# EAGLE design irams2 (EAGLE 5.11)
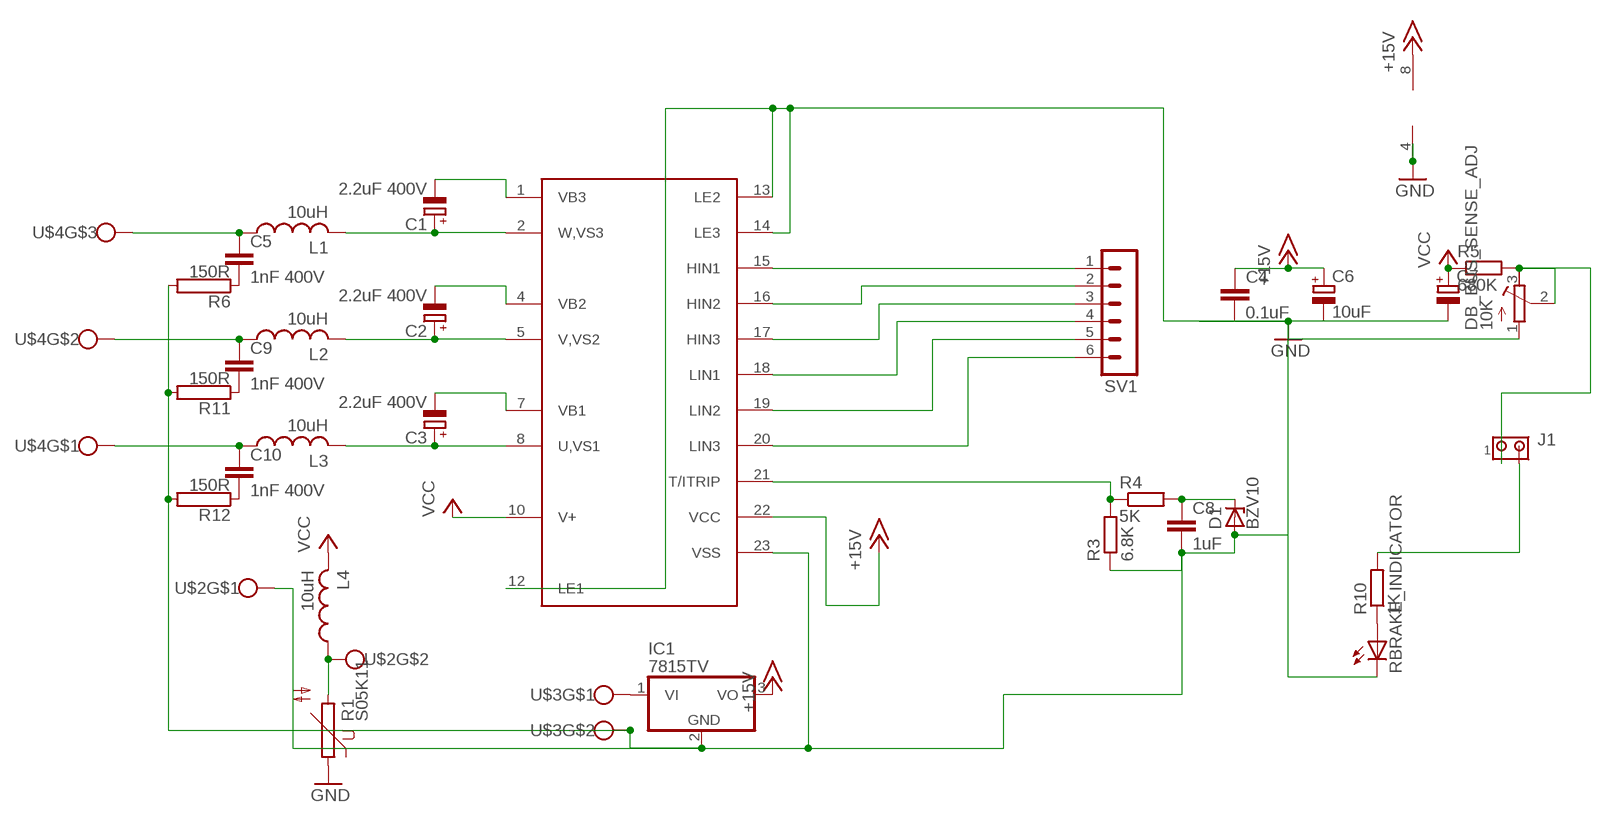
[diagram p0: schematic, sheet 1]

## Parts
C1  2.2uF 400V  CPOL-EUE5-10.5  [E5-10,5]
C2  2.2uF 400V  CPOL-EUE5-10.5  [E5-10,5]
C3  2.2uF 400V  CPOL-EUE5-10.5  [E5-10,5]
C4  0.1uF  C-EUC0805K  [C0805K]
C5  1nF 400V  C-EU075-063X106  [C075-063X106]
C6  10uF  CPOL-EUE2.5-5  [E2,5-5]
C7  CPOL-EUE10-30  [EB30D]
C8  1uF  C-EUC0805K  [C0805K]
C9  1nF 400V  C-EU075-063X106  [C075-063X106]
C10  1nF 400V  C-EU075-063X106  [C075-063X106]
D1  BZV10  ZENER-DIODESOD80C  [SOD80C]
DB_BUS_SENSE_ADJ  10K  R-TRIMM3339P  [RTRIM3339P]
IC1  7815TV  [TO220V]
IC2  LM358D  [SO08]
J1  MTA02-100  [10X02MTA]
L1  10uH  L-USTJ3-U1  [TJ3-U1]
L2  10uH  L-USTJ3-U1  [TJ3-U1]
L3  10uH  L-USTJ3-U1  [TJ3-U1]
L4  10uH  L-USTJ3-U1  [TJ3-U1]
R1  S05K11  [S05K11]
R3  6.8K  R-EU_M0805  [M0805]
R4  5K  R-EU_M0805  [M0805]
R5  680K  R-EU_0204/7  [0204/7]
R6  150R  RKH216-8  [KH216-8]
R10  1K  R-EU_M0805  [M0805]
R11  150R  RKH216-8  [KH216-8]
R12  150R  RKH216-8  [KH216-8]
RBRAKE_INDICATOR  LED5MM  [LED5MM]
SV1  MA06-1  [MA06-1]
U$1  IRAMS06UP60A  IRAMS06UP60ASIP-1  [SIP-1]
U$2  110/2  [110/2]
U$3  110/2  [110/2]
U$4  110/3  [110/3]

## Nets
+15V: C4.1 C6.+ IC1.3(VO) IC2.8(P:V+) U$1.22(VCC)
GND: C4.2 C6.- C7.- C8.2 D1.A DB_BUS_SENSE_ADJ.1(E) IC1.2(GND) IC2.4(P:V-) R1.1 R3.1 R6.2 R11.2 R12.2 RBRAKE_INDICATOR.K(C) U$1.12(LE1) U$1.13(LE2) U$1.14(LE3) U$1.23(VSS) U$2.P$1 U$3.P$2
N$1: SV1.1 U$1.15(HIN1)
N$2: SV1.2 U$1.16(HIN2)
N$3: SV1.3 U$1.17(HIN3)
N$4: SV1.4 U$1.18(LIN1)
N$5: SV1.5 U$1.19(LIN2)
N$6: SV1.6 U$1.20(LIN3)
N$7: C3.+ L3.2 U$1.8(U,VS1)
N$8: C3.- U$1.7(VB1)
N$9: C2.+ L2.2 U$1.5(V,VS2)
N$10: C2.- U$1.4(VB2)
N$11: C1.+ L1.2 U$1.2(W,VS3)
N$12: C1.- U$1.1(VB3)
N$13: L4.1 R1.2 U$2.P$2
N$15: DB_BUS_SENSE_ADJ.2(S) DB_BUS_SENSE_ADJ.3(A) J1.1 R5.2
N$16: R10.1 RBRAKE_INDICATOR.A
N$18: IC1.1(VI) U$3.P$1
N$19: R3.2 R4.1 U$1.21(T/ITRIP)
N$20: C8.1 D1.C R4.2
N$24: J1.2 R10.2
N$26: C5.1 L1.1 U$4.P$3
N$27: C9.1 L2.1 U$4.P$2
N$28: C10.1 L3.1 U$4.P$1
N$29: C9.2 R11.1
N$30: C10.2 R12.1
N$31: C5.2 R6.1
VCC: C7.+ L4.2 R5.1 U$1.10(V+)
Unconnected: IC2.1(A:OUT) IC2.2(A:-IN) IC2.3(A:+IN) IC2.5(B:+IN) IC2.6(B:-IN) IC2.7(B:OUT)

## Library data of the parts
C1-C3 C6 C7 = resistor:CPOL-EU: POLARIZED CAPACITOR, European symbol
C4 C5 C8-C10 = resistor:C-EU: CAPACITOR, European symbol
D1 = diode:ZENER-DIODE: Z-Diode
DB_BUS_SENSE_ADJ = resistor:R-TRIMM: Trimm resistor
IC1 = linear:78*: Positive VOLTAGE REGULATOR Source: http://cache.national.com/ds/LM/LM78L05.pdf http://www.fairchildsemi.com/ds/LM/LM7805.pdf
IC2 = linear:LM358: OP AMP also LM158; LM258; LM2904 Source: http://cache.national.com/ds/LM/LM158.pdf
J1 = con-amp:MTA02-100: AMP connector; OC_FARNELL: unknown; OC_NEWARK: unknown
L1-L4 = resistor:L-US: INDUCTOR, American symbol
R1 = varistor:S05K11: VARISTOR
R3 R4 R10 = resistor:R-EU_: RESISTOR, European symbol
R5 = rcl:R-EU_: RESISTOR, European symbol
R6 R11 R12 = resistor-power:R: Power Resitor; OC_FARNELL: unknown; OC_NEWARK: unknown
RBRAKE_INDICATOR = led:LED: LED OSRAM: - CHIPLED LG R971, LG N971, LY N971, LG Q971, LY Q971, LO R971, LY R971 LH N974, LH R974 LS Q976, LO Q976, LY Q976 LO Q996 - Hyper CHIPLED LW Q18S LB Q993, LB Q99A, LB R99A - SideLED LS A670, LO A670, LY A670, LG A670, LP A670 LB A673, LV A673, LT A673, LW A673 LH A674 LY A675 LS A676, LA A676, LO A676, LY A676, LW A676 LS A679, LY A679, LG A679 - Hyper Micro SIDELED® LS Y876, LA Y876, LO Y876, LY Y876 LT Y87S - SmartLED LW L88C, LW L88S LB L89C, LB L89S, LG L890 LS L89K, LO L89K, LY L89K LS L896, LA L896, LO L896, LY L896 - TOPLED LS T670, LO T670, LY T670, LG T670, LP T670 LSG T670, LSP T670, LSY T670, LOP T670, LYG T670 LG T671, LOG T671, LSG T671 LB T673, LV T673, LT T673, LW T673 LH T674 LS T676, LA T676, LO T676, LY T676, LB T676, LH T676, LSB T676, LW T676 LB T67C, LV T67C, LT T67C, LS T67K, LO T67K, LY T67K, LW E67C LS E67B, LA E67B, LO E67B, LY E67B, LB E67C, LV E67C, LT E67C LW T67C LS T679, LY T679, LG T679 LS T770, LO T770, LY T770, LG T770, LP T770 LB T773, LV T773, LT T773, LW T773 LH T774 LS E675, LA E675, LY E675, LS T675 LS T776, LA T776, LO T776, LY T776, LB T776 LHGB T686 LT T68C, LB T68C - Hyper Mini TOPLED® LB M676 - Mini TOPLED Santana® LG M470 LS M47K, LO M47K, LY M47K Source: http://www.osram.convergy.de LUXEON: - LUMILED® LXK2-PW12-R00, LXK2-PW12-S00, LXK2-PW14-U00, LXK2-PW14-V00 LXK2-PM12-R00, LXK2-PM12-S00, LXK2-PM14-U00 LXK2-PE12-Q00, LXK2-PE12-R00, LXK2-PE12-S00, LXK2-PE14-T00, LXK2-PE14-U00 LXK2-PB12-K00, LXK2-PB12-L00, LXK2-PB12-M00, LXK2-PB14-N00, LXK2-PB14-P00, LXK2-PB14-Q00 LXK2-PR12-L00, LXK2-PR12-M00, LXK2-PR14-Q00, LXK2-PR14-R00 LXK2-PD12-Q00, LXK2-PD12-R00, LXK2-PD12-S00 LXK2-PH12-R00, LXK2-PH12-S00 LXK2-PL12-P00, LXK2-PL12-Q00, LXK2-PL12-R00 Source: www.luxeon.com KINGBRIGHT: KA-3528ASYC Source: www.kingbright.com
SV1 = con-lstb:MA06-1: PIN HEADER; OC_FARNELL: unknown; OC_NEWARK: unknown
U$1 = motor driver parts:IRAMS06UP60A
U$2 U$3 = con-wago-500:110/2
U$4 = con-wago-500:110/3

## Board
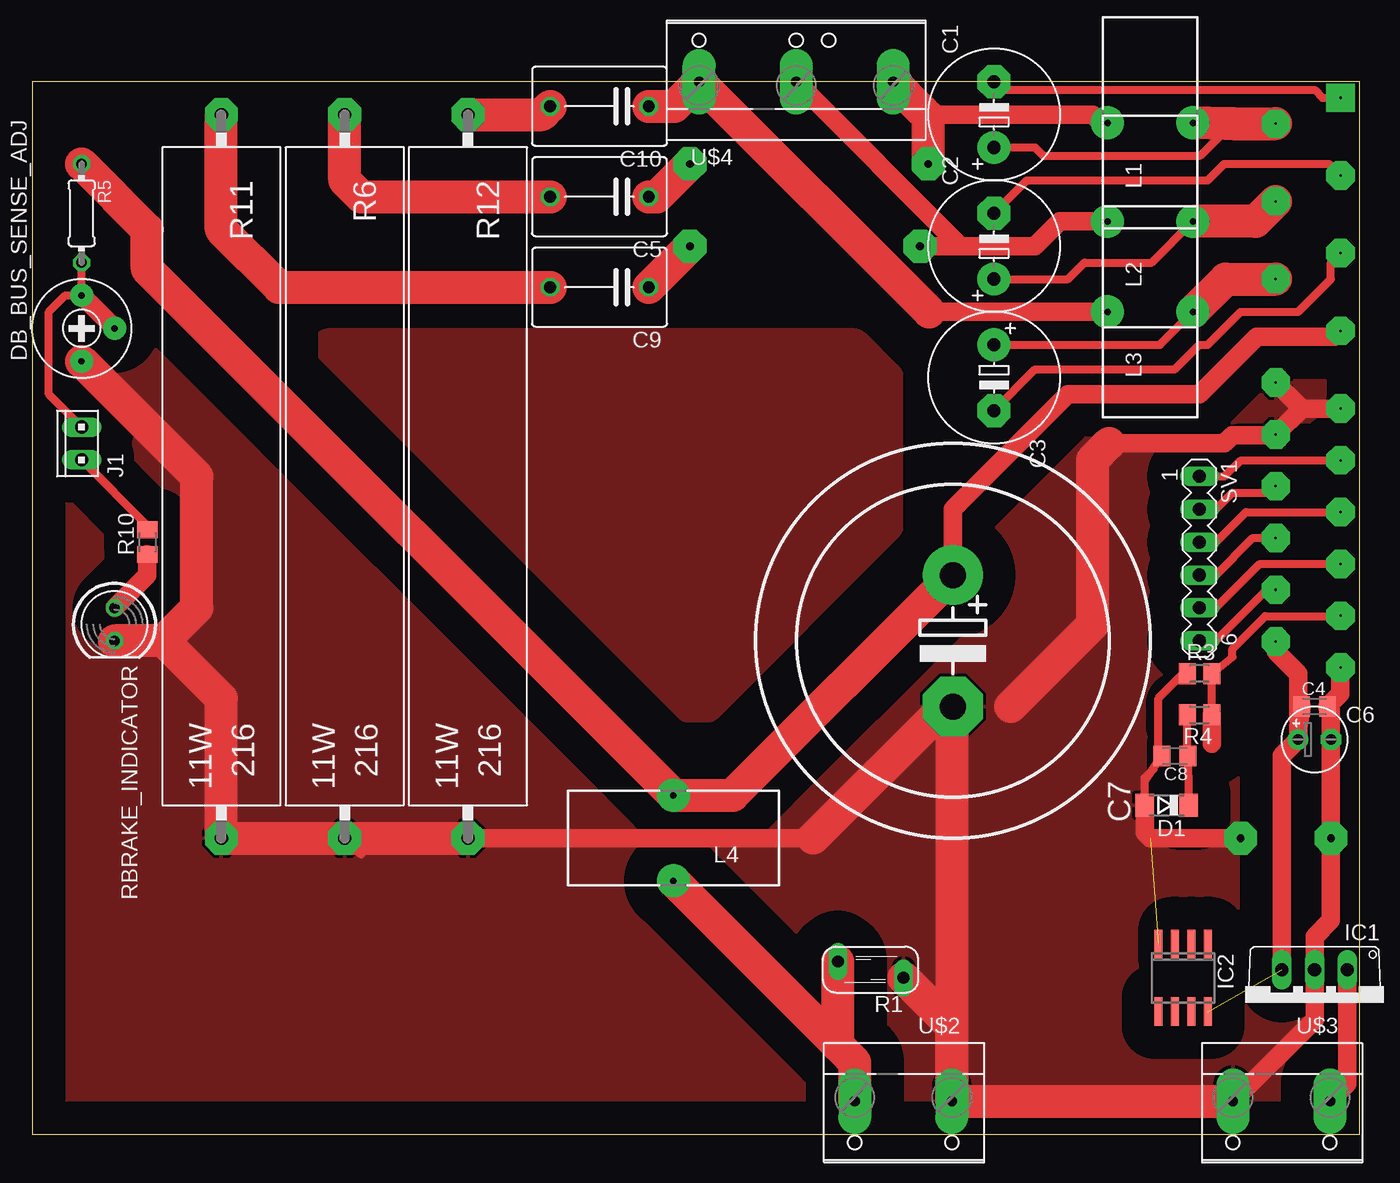
[diagram p1: board, top side]
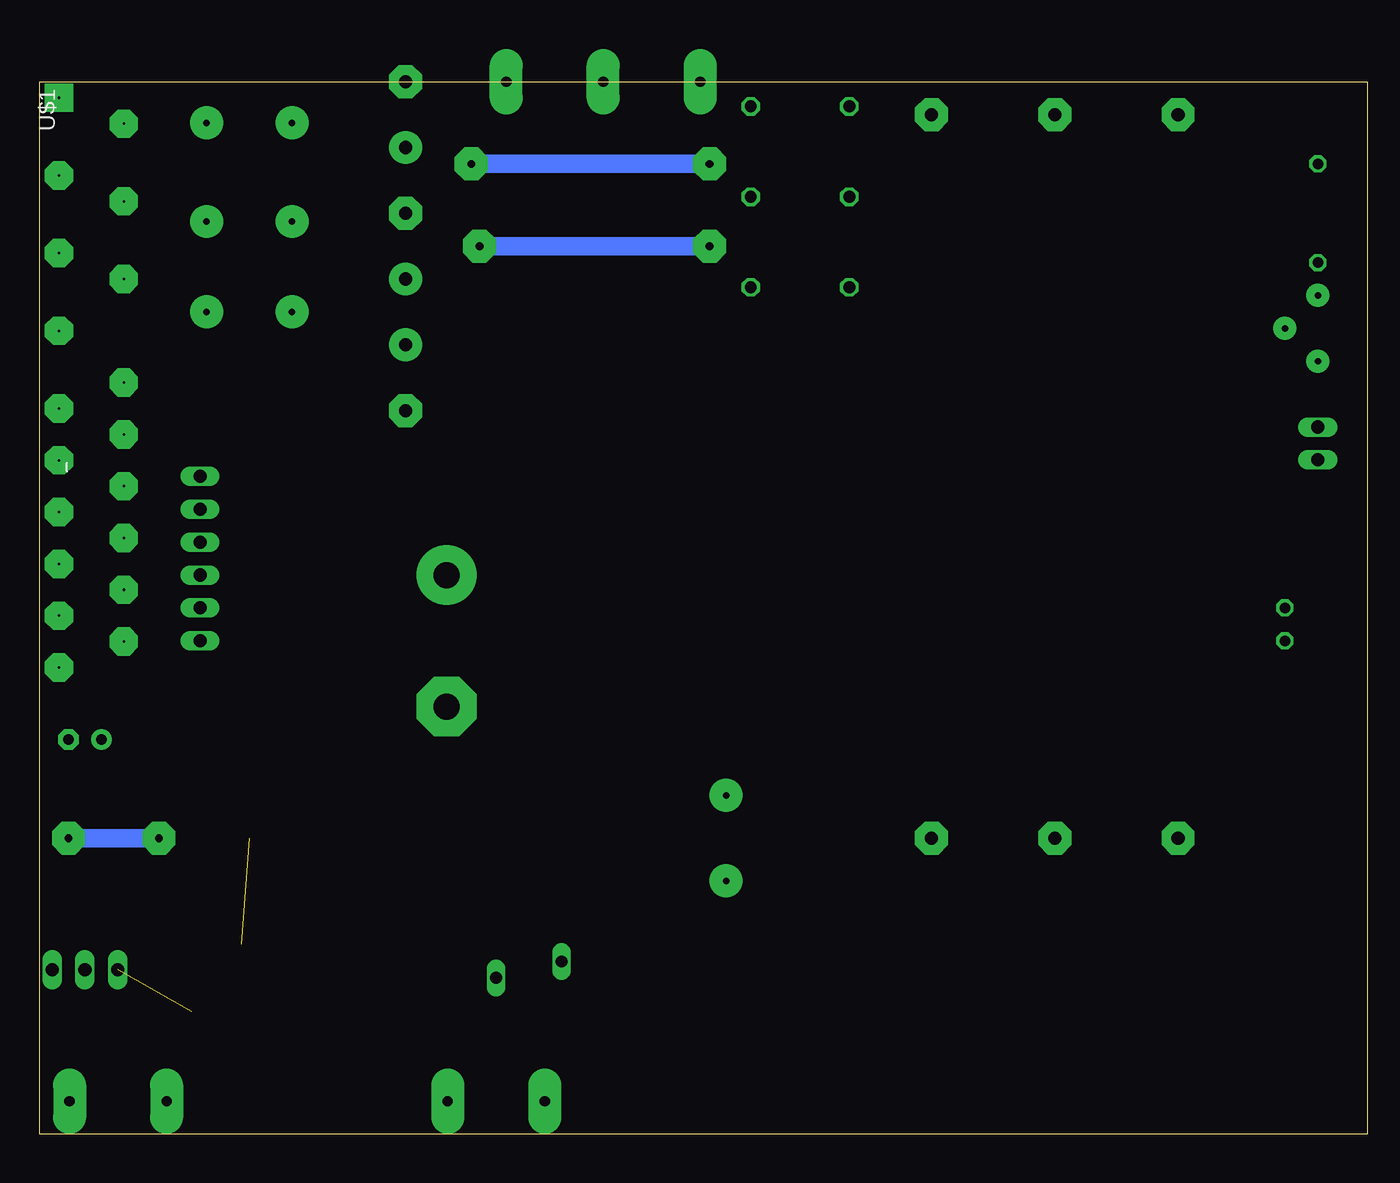
[diagram p2: board, bottom side, seen from below]

Size 102.54 x 81.27 mm. Coordinates in mm from the lower left corner, seen from the top.
Outline: 0,0 102.54,0 102.54,81.27 0,81.27 0,0
Copper layers (1*16): Top 0.035mm / dielectric 1.5mm / Bottom 0.035mm
Design rules "default": minimum track width 10mil, minimum drill 24mil, track to track 8mil, track to pad 8mil, pad to pad 8mil, via to via 8mil, smd to smd 8mil, copper to edge 40mil, drill to drill 8mil, minimum pad ring 10mil, minimum via ring 8mil, stop-mask expansion 4mil, vias tented up to drill 0mil, thermal gap 10mil

### Footprints (pad centres in the part's own frame; a part is rotated, then mirrored left to right if it is on the bottom)
E5-10,5 = drill 1.016 pad 2.54 round: + -2.54,0 | drill 1.016 pad 2.54 octagon: - 2.54,0
C0805K = smd 1.3 x 1.6: 1 -1,0; 2 1,0
C075-063X106 = drill 0.914 octagon: 1 -3.81,0; 2 3.81,0
E2,5-5 = drill 0.813 pad 1.6 round: + -1.27,0 | drill 0.813 pad 1.6 octagon: - 1.27,0
EB30D = drill 2.007 pad 4.597 round: + -5.08,0 | drill 2.007 pad 4.597 octagon: - 5.08,0
SOD80C = smd 1.4 x 1.8: A 1.7,0; C -1.7,0
RTRIM3339P = drill 0.5 pad 1.778 round: 1 -2.54,0; 2 0,-2.54; 3 2.54,0
TO220V = drill 1.016 long: 1 -2.54,-2.54; 2 0,-2.54; 3 2.54,-2.54
SO08 = smd 0.6 x 2.2: 1 -1.905,-2.6; 2 -0.635,-2.6; 3 0.635,-2.6; 4 1.905,-2.6; 5 1.905,2.6; 6 0.635,2.6; 7 -0.635,2.6; 8 -1.905,2.6
10X02MTA = drill 1.016 long: 1 1.27,0; 2 -1.27,0
TJ3-U1 = drill 0.5 pad 2.54 round: 1 -3.3,0; 2 3.3,0
S05K11 = drill 0.914 long: 1 -0.635,-2.54; 2 0.635,2.54
M0805 = smd 1.3 x 1.6: 1 -0.95,0; 2 0.95,0
0204/7 = drill 0.813 octagon: 1 -3.81,0; 2 3.81,0
KH216-8 = drill 1.016 pad 2.54 octagon: 1 -27.94,0; 2 27.94,0
LED5MM = drill 0.813 octagon: A -1.27,0; K 1.27,0
MA06-1 = drill 1.016 long: 1 -6.35,0; 2 -3.81,0; 3 -1.27,0; 4 1.27,0; 5 3.81,0; 6 6.35,0
SIP-1 = drill 0.2 pad 2.184 square: 1 -14,-2 | drill 0.2 pad 2.184 octagon: 2 -12,3; 4 -8,-2; 5 -6,3; 7 -2,-2; 8 0,3; 10 4,-2; 12 8,3; 13 10,-2; 14 12,3; 15 14,-2; 16 16,3; 17 18,-2; 18 20,3; 19 22,-2; 20 24,3; 21 26,-2; 22 28,3; 23 30,-2
110/2 = drill 0.8 pad 2.54 long: P$1 -3.73,0; P$2 3.77,0
110/3 = drill 0.8 pad 2.54 long: P$1 -5,0; P$2 2.5,0; P$3 10,0

### Placement (x,y rotation side)
C1  74.3,78.74 90 top
C2  74.3,68.58 90 top
C3  74.3,58.42 270 top
C4  99.06,33.02 0 top
C5  43.81,72.39 180 top
C6  99.06,30.48 0 top
C7  71.12,38.1 270 top
C8  88.27,29.21 180 top
C9  43.81,65.41 180 top
C10  43.81,79.38 180 top
D1  87.63,25.4 180 top
DB_BUS_SENSE_ADJ  3.81,62.23 90 top
IC1  99.06,10.16 180 top
IC2  88.9,12.06 180 top
J1  3.81,53.34 90 top
L1  86.36,78.11 0 top
L2  86.36,70.48 0 top
L3  86.36,63.5 0 top
L4  49.53,22.86 90 top
R1  64.77,12.7 90 top
R3  90.17,35.56 0 top
R4  90.17,32.38 180 top
R5  3.81,71.12 270 top
R6  24.13,50.8 270 top
R10  8.89,45.72 90 top
R11  14.61,50.8 270 top
R12  33.66,50.8 270 top
RBRAKE_INDICATOR  6.35,39.37 270 top
SV1  90.17,44.45 270 top
U$1  99.06,66.04 270 bottom
U$2  67.31,2.54 180 top
U$3  96.52,2.54 180 top
U$4  56.52,81.28 0 top

### Tracks (layer width: path | path; a pad name or v marks a point on that pad's centre or on a via)
+15V  (1 unrouted)
  Top 1.422: U$1.22 96.06,37.29 97.79,35.56 97.79,32.02 C4.1 97.79,31.48 C6.+ 96.52,29.21 IC1.3
GND  (via drill 0.6 pad 2.54)  (1 unrouted)
  Top 0.61: D1.A 85.93,27.24 | 85.93,27.24 C8.2 87,29.48 87,33.66 88.9,35.56 R3.1 | 86.63,28.21 85.93,27.51 85.93,27.24 | R6.2 25.4,21.59
  Top 1.422: D1.A 85.93,23.29 86.36,22.86 v93.34,22.86 | U$3.P$2 99.06,8.85 IC1.2 99.06,15.24 100.33,16.51 v100.33,22.86 C6.- 100.33,32.75 C4.2 101.06,34.02 U$1.23 | 98.06,56.04 U$1.12 | 98.06,56.04 U$1.13 | 98.06,56.04 U$1.14 96,53.98 92.71,53.98 92.08,53.34 83.19,53.34 | 70.48,33.02 71.04,32.47 | R12.2 60.33,22.86
  Top 2.54: 10.16,38.1 RBRAKE_INDICATOR.K | 10.16,38.1 12.7,40.64 12.7,50.8 DB_BUS_SENSE_ADJ.1 | 10.16,38.1 14.61,33.66 R11.2 R6.2 R12.2 | U$2.P$1 U$3.P$2 | 83.19,53.34 81.92,52.07 81.92,39.37 75.56,33.02 | 71.04,32.47 U$2.P$1 | 60.33,22.86 70.48,33.02 | R1.1 71.04,8.34 U$2.P$1
  Bottom 1.422: v100.33,22.86 v93.34,22.86
  pour Top (isolate 2.54): 0,0 102.87,0 102.87,81.28 0,81.28
N$1
  Top 0.61: SV1.1 92.08,50.8 93.38,52.04 U$1.15
N$2
  Top 0.61: SV1.2 91.44,48.26 92.71,49.53 95.25,49.53 95.76,50.04 U$1.16
N$3
  Top 0.61: SV1.3 91.44,45.72 93.76,48.04 U$1.17
N$4
  Top 0.61: SV1.4 91.44,43.18 94.3,46.04 U$1.18
N$5
  Top 0.61: SV1.5 91.44,40.64 94.84,44.04 U$1.19
N$6
  Top 0.61: SV1.6 91.44,38.1 95.38,42.04 U$1.20
N$7
  Top 0.61: L3.2 87.12,60.96 C3.+
  Top 2.54: U$1.8 92.2,66.04 L3.2
N$8
  Top 0.61: U$1.7 100.33,67.31 100.33,66.04 97.79,63.5 93.34,63.5 90.81,60.96 90.17,60.96 88.27,59.05 77.47,59.05 C3.-
N$9
  Top 0.61: L2.2 86.48,67.31 81.28,67.31 80.01,66.04 C2.+
  Top 2.54: U$1.5 94.5,70.48 L2.2
N$10
  Top 0.61: C2.- 76.83,73.66 90.81,73.66 92.08,74.93 100.17,74.93 U$1.4
N$11
  Top 0.61: C1.+ 77.47,76.2 78.11,75.56 90.23,75.56 92.71,78.04
  Top 2.54: U$1.2 92.71,78.04 92.27,78.04 L1.2
N$12
  Top 0.61: U$1.1 99.67,80.04 99.06,80.64 74.42,80.64 C1.-
N$13
  Top 2.54: 62.23,6.86 L4.1 | U$2.P$2 63.54,5.55 63.12,5.97 62.23,6.86 | 62.23,6.86 R1.2
N$14
  pour Top: 22.86,60.96 50.8,33.02 52.07,33.02 66.04,46.99 66.04,48.26 66.04,58.42 63.5,60.96
N$15
  Top 0.61: J1.1 1.27,57.15 1.27,63.5 2.54,64.77 DB_BUS_SENSE_ADJ.3 R5.2
  Top 1.422: DB_BUS_SENSE_ADJ.3 DB_BUS_SENSE_ADJ.2
N$16
  Top 1.422: R10.1 8.89,43.18 RBRAKE_INDICATOR.A
N$18
  Top 1.422: U$3.P$1 101.6,3.89 IC1.1
N$19
  Top 0.61: R3.2 92.71,36.83 92.71,37.47 95.25,40.01 101.03,40.01 U$1.21 | R3.2 90.81,35.24 | R4.1 R3.2
  Top 1.422: 91.12,30.16 R4.1
N$20
  Top 0.61: D1.C 89.33,27.24 C8.1 89.22,29.25 R4.2
N$24
  Top 0.61: J1.2 8.89,46.99 R10.2
N$26  (via drill 0.6 pad 2.54)
  Top 1.422: L1.1 82.55,78.11 81.92,78.74 69.06,78.74 | 69.06,78.74 68.82,78.98 | 69.22,78.58 69.06,78.74
  Top 2.54: 68.82,78.98 U$4.P$3 | C5.1 48.26,72.39 v50.8,74.93 | v69.22,74.93 69.22,78.58
  Bottom 1.422: v50.8,74.93 v69.22,74.93
N$27  (via drill 0.6 pad 2.54)
  Top 1.422: L2.1 79.38,70.48 77.47,68.58 72.39,68.58 71.72,68.58 | 71.72,68.58 U$4.P$2 | v68.58,68.58 71.72,68.58
  Top 2.54: C9.1 v50.8,68.58
  Bottom 1.422: v50.8,68.58 v68.58,68.58
N$28
  Top 1.422: 69.3,63.5 L3.1
  Top 2.54: 69.3,63.5 U$4.P$1 49.61,79.38 C10.1
N$29
  Top 2.54: C9.2 19.05,65.41 14.61,69.85 R11.1
N$30
  Top 2.54: R12.1 39.37,78.74 C10.2
N$31
  Top 2.54: R6.1 24.13,73.66 25.4,72.39 C5.2
VCC
  Top 1.422: U$1.10 100.61,61.59 94.61,61.59 90.17,57.15 80.01,57.15 71.12,48.26 C7.+
  Top 2.54: C7.+ 54.1,26.16 L4.2 8.89,66.8 8.89,69.85 R5.1